# EAGLE schematic schema (EAGLE 8.6.0)
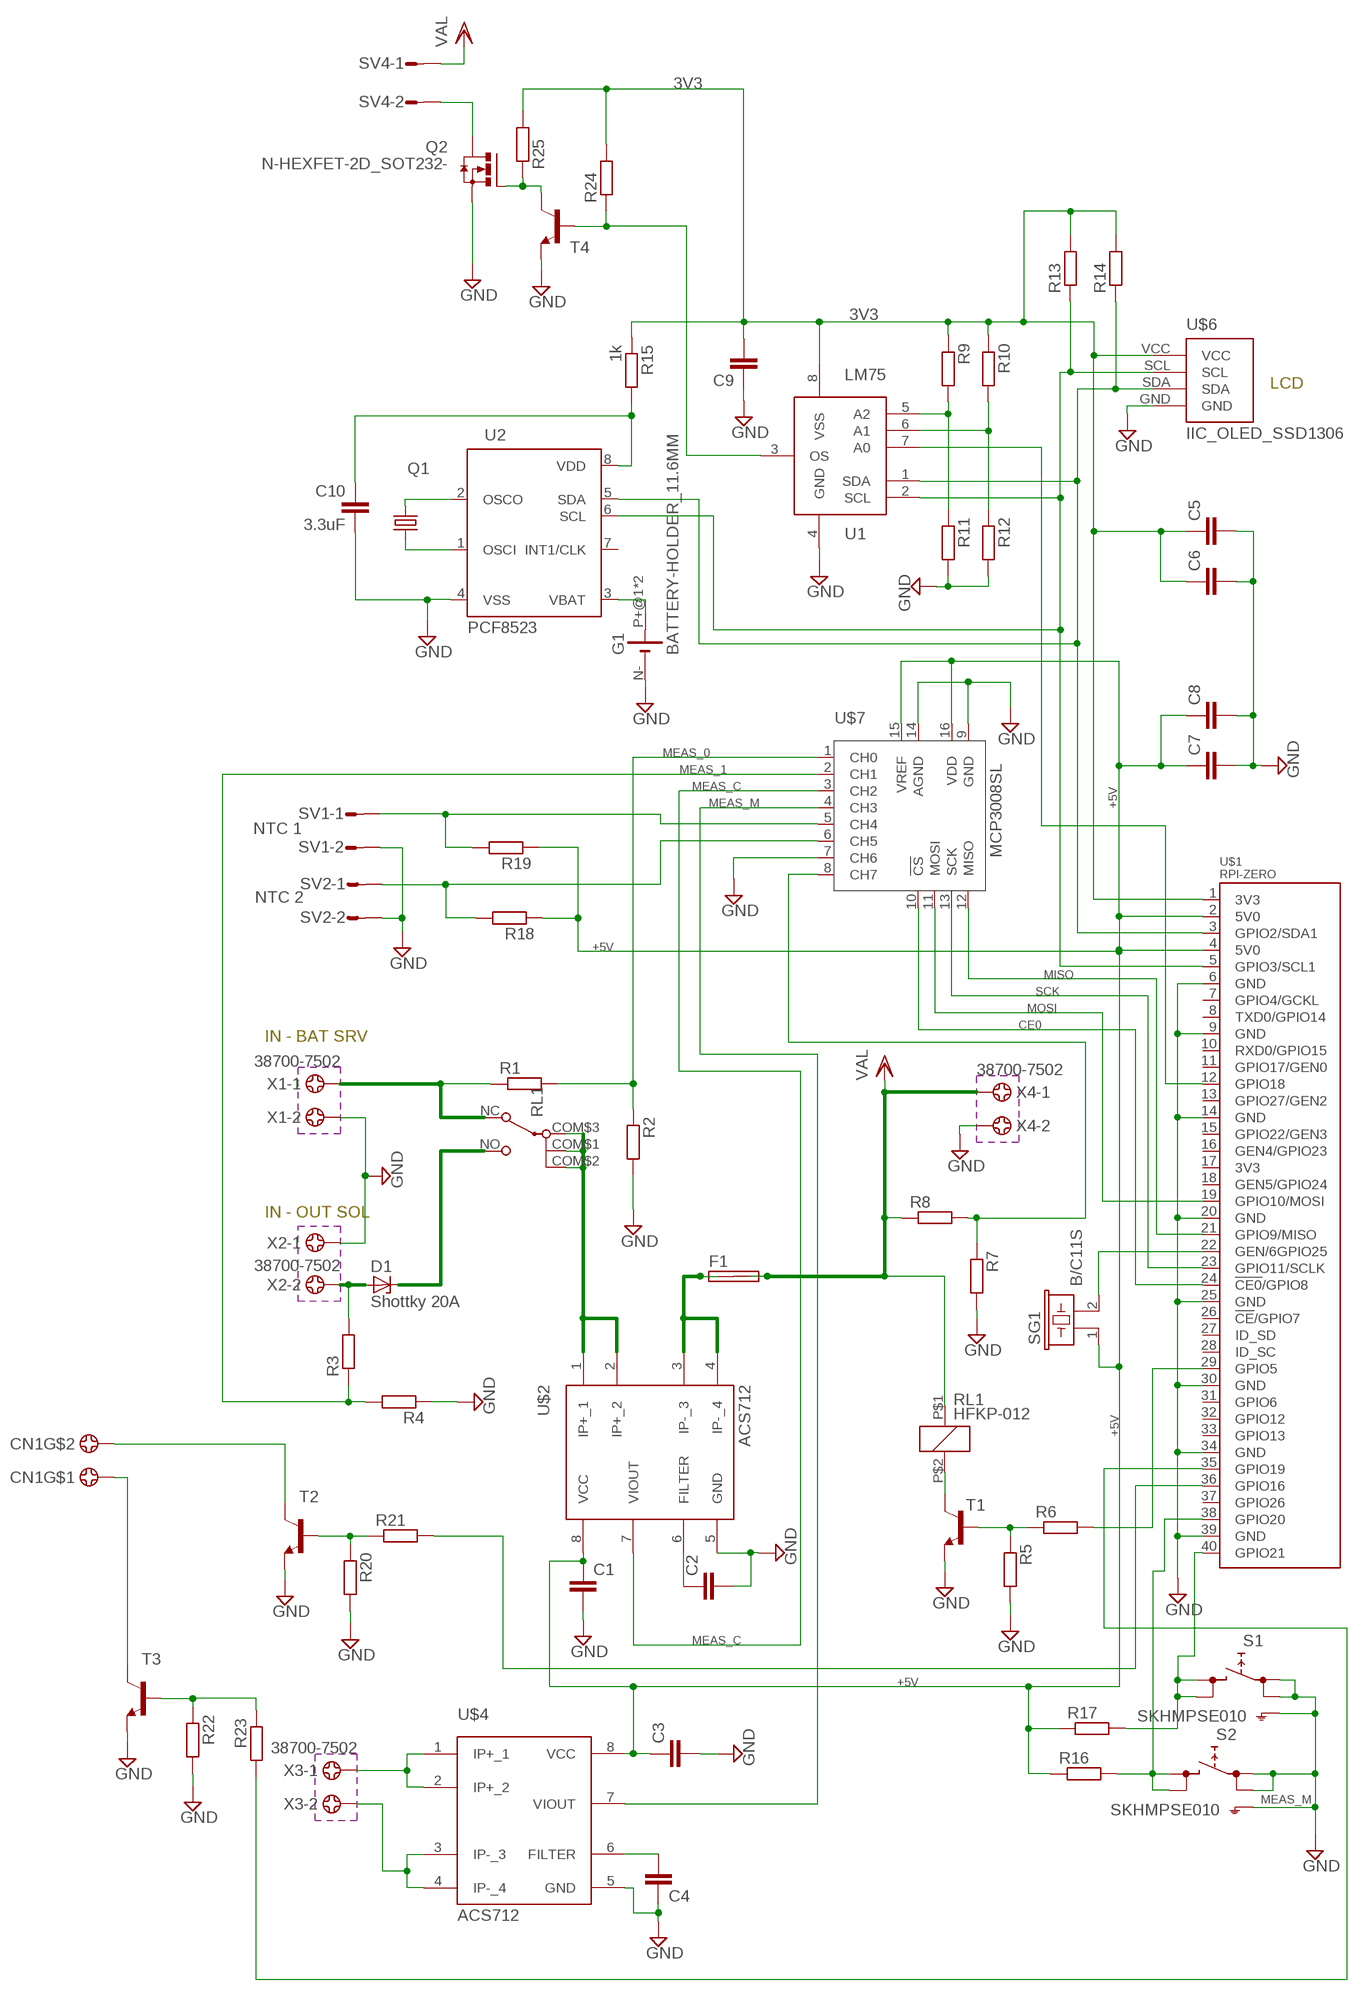
[diagram p0: schematic, sheet 1]

## Parts
C1  CC0603  [C0603]
C2  CC0603  [C0603]
C3  CC0603  [C0603]
C4  CC0603  [C0603]
C5  CC0603  [C0603]
C6  CC0603  [C0603]
C7  CC0603  [C0603]
C8  CC0603  [C0603]
C9  CC0603  [C0603]
C10  3.3uF  CC0603  [C0603]
CN1  CON_VITE_2POS  [CN02]
D1  Shottky 20A  ZENER-DIODEC1702-15  [C1702-15]
F1  SHK20Q  [SHK20Q]
G1  BATTERY-HOLDER_11.6MM  [CELL_RETAINER_11.6MM]
Q1  KX-327-S  [8.2X3.8]
Q2  N-HEXFET-2D_SOT232-  [SOT223]
R1  RR0603  [R0603]
R2  RR0603  [R0603]
R3  RR0603  [R0603]
R4  RR0603  [R0603]
R5  RR0603  [R0603]
R6  RR0603  [R0603]
R7  RR0603  [R0603]
R8  RR0603  [R0603]
R9  RR0603  [R0603]
R10  RR0603  [R0603]
R11  RR0603  [R0603]
R12  RR0603  [R0603]
R13  RR0603  [R0603]
R14  RR0603  [R0603]
R15  1k  RR0603  [R0603]
R16  RR0603  [R0603]
R17  RR0603  [R0603]
R18  RR0603  [R0603]
R19  RR0603  [R0603]
R20  RR0603  [R0603]
R21  RR0603  [R0603]
R22  RR0603  [R0603]
R23  RR0603  [R0603]
R24  RR0603  [R0603]
R25  RR0603  [R0603]
RL1  HFKP-012  HKFP012-1X5  [HFKP-1X5]
S1  SKHMPSE010  [SKHMPXE010]
S2  SKHMPSE010  [SKHMPXE010]
SG1  B/C11S  [B/C11S]
SV1  S02P  [S02P]
SV2  S02P  [S02P]
SV4  S02P  [S02P]
T1  -NPN-SOT23-EBC  [SOT23-EBC]
T2  -NPN-SOT23-EBC  [SOT23-EBC]
T3  -NPN-SOT23-EBC  [SOT23-EBC]
T4  -NPN-SOT23-EBC  [SOT23-EBC]
U1  LM75  [SO08]
U2  PCF8523  [SO08-IRF]
U$1  RPI-ZERO  [RASPBERRYPI_V13_J8]
U$2  ACS712  [SOIC8]
U$4  ACS712  [SOIC8]
U$6  IIC_OLED_SSD1306  [OLED-SSD1306]
U$7  MCP3008SL  [SO16]
X1  38700-7502  [38700-7502]
X2  38700-7502  [38700-7502]
X3  38700-7502  [38700-7502]
X4  38700-7502  [38700-7502]

## Nets
3V3: C5.1 C6.1 C9.2 R9.1 R10.1 R13.2 R14.2 R15.1 R24.2 R25.2 U1.8(VSS) U$1.1(3V3) U$6.VCC
+5V: C1.1 C3.1 C7.1 C8.1 R16.1 R17.1 R18.1 R19.1 SG1.1 U$1.2(5V0) U$1.4(5V0) U$2.8(VCC) U$4.8(VCC) U$7.15(VREF) U$7.16(VDD)
CE0: U$1.24(!CE0!/GPIO8) U$7.10(!CS)
GND: C1.2 C2.2 C3.2 C4.1 C5.2 C6.2 C7.2 C8.2 C9.1 C10.2 G1.N-(-) Q2.3(S) R2.2 R4.1 R5.2 R7.2 R11.2 R12.2 R20.2 R22.2 S1.1(1.1) S1.2(1.2) S1.5(SH) S2.1(1.1) S2.2(1.2) S2.5(SH) SV1.2 SV2.2 T1.E T2.E T3.E T4.E U1.4(GND) U2.4(VSS) U$1.6(GND) U$1.9(GND) U$1.14(GND) U$1.20(GND) U$1.25(GND) U$1.30(GND) U$1.34(GND) U$1.39(GND) U$2.5(GND) U$4.5(GND) U$6.GND U$7.7(CH6) U$7.9(GND) U$7.14(AGND) X1.2 X2.1 X4.2
MEAS_0: R1.2 R2.1 U$7.1(CH0)
MEAS_1: R3.1 R4.2 U$7.2(CH1)
MEAS_C: U$2.7(VIOUT) U$7.3(CH2)
MEAS_M: U$4.7(VIOUT) U$7.4(CH3)
MEAS_O: R7.1 R8.2 U$7.8(CH7)
MISO: U$1.21(GPIO9/MISO) U$7.12(MISO)
MOSI: U$1.19(GPIO10/MOSI) U$7.11(MOSI)
N$1: R1.1 X1.1
N$2: R9.2 R11.1 U1.5(A2)
N$3: RL1.COM$1(P1) RL1.COM$2(P2) RL1.COM$3(P3) U$2.1(IP+_1) U$2.2(IP+_2)
N$4: D1.A R3.2 X2.2
N$5: D1.C RL1.NO(S)
N$6: C4.2 U$4.6(FILTER)
N$7: F1.1A F1.1B U$2.3(IP-_3) U$2.4(IP-_4)
N$8: U$4.1(IP+_1) U$4.2(IP+_2) X3.1
N$9: C2.1 U$2.6(FILTER)
N$10: U$4.3(IP-_3) U$4.4(IP-_4) X3.2
N$12: R5.1 R6.1 T1.B
N$13: R10.2 R12.1 U1.6(A1)
N$14: RL1.P$2 T1.C
N$15: R6.2 U$1.29(GPIO5)
N$16: U1.7(A0) U$1.12(GPIO18)
N$17: SG1.2 U$1.22(GEN/6GPIO25)
N$18: G1.P+@1(+) G1.P+@2(+) U2.3(VBAT)
N$19: Q1.4 U2.1(OSCI)
N$20: Q1.1 U2.2(OSCO)
N$21: C10.1 R15.2 U2.8(VDD)
N$22: R16.2 S2.3(2.1) S2.4(2.2) U$1.38(GPIO20)
N$23: R17.2 S1.3(2.1) S1.4(2.2) U$1.40(GPIO21)
N$24: CN1.P$2 T2.C
N$25: R20.1 R21.1 T2.B
N$26: R19.2 SV1.1 U$7.5(CH4)
N$27: R18.2 SV2.1 U$7.6(CH5)
N$28: R21.2 U$1.36(GPIO16)
N$29: CN1.P$1 T3.C
N$30: R22.1 R23.1 T3.B
N$31: R24.1 T4.B U1.3(OS)
N$32: R23.2 U$1.35(GPIO19)
N$33: Q2.1(G) R25.1 T4.C
N$35: Q2.2(D) Q2.4(D) SV4.2
SCK: U$1.23(GPIO11/SCLK) U$7.13(SCK)
SCL: R13.1 U1.2(SCL) U2.6(SCL) U$1.5(GPIO3/SCL1) U$6.SCL
SDA: R14.1 U1.1(SDA) U2.5(SDA) U$1.3(GPIO2/SDA1) U$6.SDA
VDD: F1.2A F1.2B R8.1 RL1.P$1 SV4.1 X4.1 ; supply symbol labelled VAL
Unconnected: RL1.NC(O) U2.7(INT1/CLK) U$1.7(GPIO4/GCKL) U$1.8(TXD0/GPIO14) U$1.10(RXD0/GPIO15) U$1.11(GPIO17/GEN0) U$1.13(GPIO27/GEN2) U$1.15(GPIO22/GEN3) U$1.16(GEN4/GPIO23) U$1.17(3V3) U$1.18(GEN5/GPIO24) U$1.26(!CE!/GPIO7) U$1.27(ID_SD) U$1.28(ID_SC) U$1.31(GPIO6) U$1.32(GPIO12) U$1.33(GPIO13) U$1.37(GPIO26)

## Notes on the sheet
- LCD
- NTC 1
- NTC 2
- IN - BAT SRV
- IN - OUT SOL

## Library data of the parts
C1-C10 = eagle-ltspice:C: CAPACITOR, European symbol; SPICEMODEL: NONE; SPICEPREFIX: C
CN1 = mylib:CON_VITE_2POS: Connettore a vite da 2 posizioni
D1 = diode:ZENER-DIODE: Z-Diode
F1 = fuse:SHK20Q: FUSE HOLDER 5 x 20 mm, SH contact, E1207 Buerklin 64G6061; OC_FARNELL: unknown; OC_NEWARK: unknown
G1 = battery:BATTERY-HOLDER_11.6MM: 11.6mm PC BUTTON CELL RETAINER, high 5.97mm KEYSTONE ELECTRONICS CORP. Data sheet <http://www.farnell.com/cad/1718310.pdf>; MF: KEYSTONE; MPN: 2997; OC_FARNELL: 2293265
Q1 = crystal-geyer_V1_0:KX-327: Tuning Fork Crystals (kHz) SMD: KX327 - Serie Model Size l/w/h [mm] Frequency Range Frequency Stability Temp. Range [°C] Load Capacitance AECQ 200 availabel Datasheet KX-327VT KX-327FT KX-327RT KX-327NHT KX-327NHF KX-327L KX-327S 1.25/1.05/0.5 1.6/1.0/0.5 2.0/1.2/0.6 3.2/1.5/0.8 3.2/1.5/0.8 7.0/1.5/1.4 8.2/3.8/2.5 32,768 kHz 32,768 kHz 32,768 kHz 32,768 kHz 32,768 kHz 32,768 kHz 32,768 kHz ±10 … ±20ppm ±10 … ±20ppm ±10 … ±20ppm ±10 … ±20ppm ±10 … ±20ppm ±10 … ±20ppm ±5 … ±20ppm (*) -40°C …+85°C (*) -40°C …+85°C (*) -40°C …+85°C (*) -40°C …+85°C (*) -40°C …+125°C (*) -40°C …+85°C (*) -40°C …+85°C 7/9/12,5 7/9/12,5 7/9/12,6 7/9/12,5 9/12,5 7/9/12,5 6/12,5 - - - - yes - - KX-327VT.pdf <http://www.geyer-electronic.de/uploads/tx_userartikelfrequenz/GEYER-KX-327VT.pdf> KX-327FT.pdf <http://www.geyer-electronic.de/uploads/tx_userartikelfrequenz/GEYER-KX-327FT.pdf> KX-327RT.pdf <http://www.geyer-electronic.de/uploads/tx_userartikelfrequenz/GEYER-KX-327RT.pdf> KX-327NHT.pdf <http://www.geyer-electronic.de/uploads/tx_userartikelfrequenz/GEYER-KX-327NHT.pdf> KX-327NHF.pdf <http://www.geyer-electronic.de/uploads/tx_userartikelfrequenz/GEYER-KX-327NHF.pdf> KX-327L.pdf <http://www.geyer-electronic.de/uploads/tx_userartikelfrequenz/GEYER-KX-327L.pdf> KX-327S.pdf <http://www.geyer-electronic.de/uploads/tx_userartikelfrequenz/GEYER-KX-327S.pdf> <http://www.geyer-electronic.de/fileadmin/template/img/logo-geyer-electronic.png> Details see: http://www.geyer-electronic.de/Frequenz-Produkte.9.0.html Created 2016-06-07, Hans Locher 2016 (C) Geyer Quartz Technology KX327VT,KX327FT,KX327RT,KX327NHT,KX327NHF,KX327S,KX327L;125105;1610;2012;3215;7015;8238;1,25x1,05,1.25x1.05;1,6x1,0,1.6x1.0;2,0x1,2,2.0x1.2;3,2x1,5,3.2x1.5;8,2x3,8,8.2x3.8,7.0x1.5,7,0x1,532.768kHz
Q2 = transistor-power:N-HEXFET-2D_?-*: HEXFET® Power MOSFET 2 Drain connects http://www.irf.com/product-info/datasheets/data/irll014n.pdf
R1-R25 = eagle-ltspice:R: RESISTOR, European symbol; SPICEMODEL: NONE; SPICEPREFIX: R
RL1 = mylib:HKFP012-1X5: Relay 45A DC for Automotive with 12V coil
S1 S2 = switch:SKHMP*E010: 6.2 X 6.5mm TACT Switch (SMD) Source: http://www3.alps.co.jp/WebObjects/catalog.woa/PDF/E/Switch/Tact/SKHM/SKHM.PDF
SG1 = buzzer:B/C11S: BUZZER Source: Buerklin; OC_FARNELL: unknown; OC_NEWARK: unknown
SV1 SV2 SV4 = con-amp-mt:S02P: AMP MT CONNECTOR; OC_FARNELL: unknown; OC_NEWARK: unknown
T1-T4 = transistor-neu-to92:*-NPN-: NPN Transistror
U1 = umaxim:LM75: LM75 - I2C temperature sensor
U2 = mylib:PCF8523: PCF8523 I2C RTC and Calendar
U$1 = mylib:RPI-ZERO
U$2 U$4 = mylib:ACS712: Fully Integrated, Hall Effect-Based Linear Current Sensor IC
U$6 = mylib:IIC_OLED_SSD1306: I2C OLED 128x64
U$7 = MCP3008:MCP3008
X1-X4 = mylib:38700-7502: Barrier Blocks Molex serie 38700 Morsettiera a barriera S/R barr.325 2ckt P PC term SEM no ends (passo 8.25mm) Source: https://www.mouser.com/ds/2/276/0387007502_TERMINAL_BLOCKS-138515.pdf Draw: http://www.molex.com/pdm_docs/sd/387007502_sd.pdf; OC_FARNELL: unknown; OC_MOUSER: 538-38700-7502; OC_NEWARK: unknown